# Altium schematic sheet BEEP.SchDoc
size A4
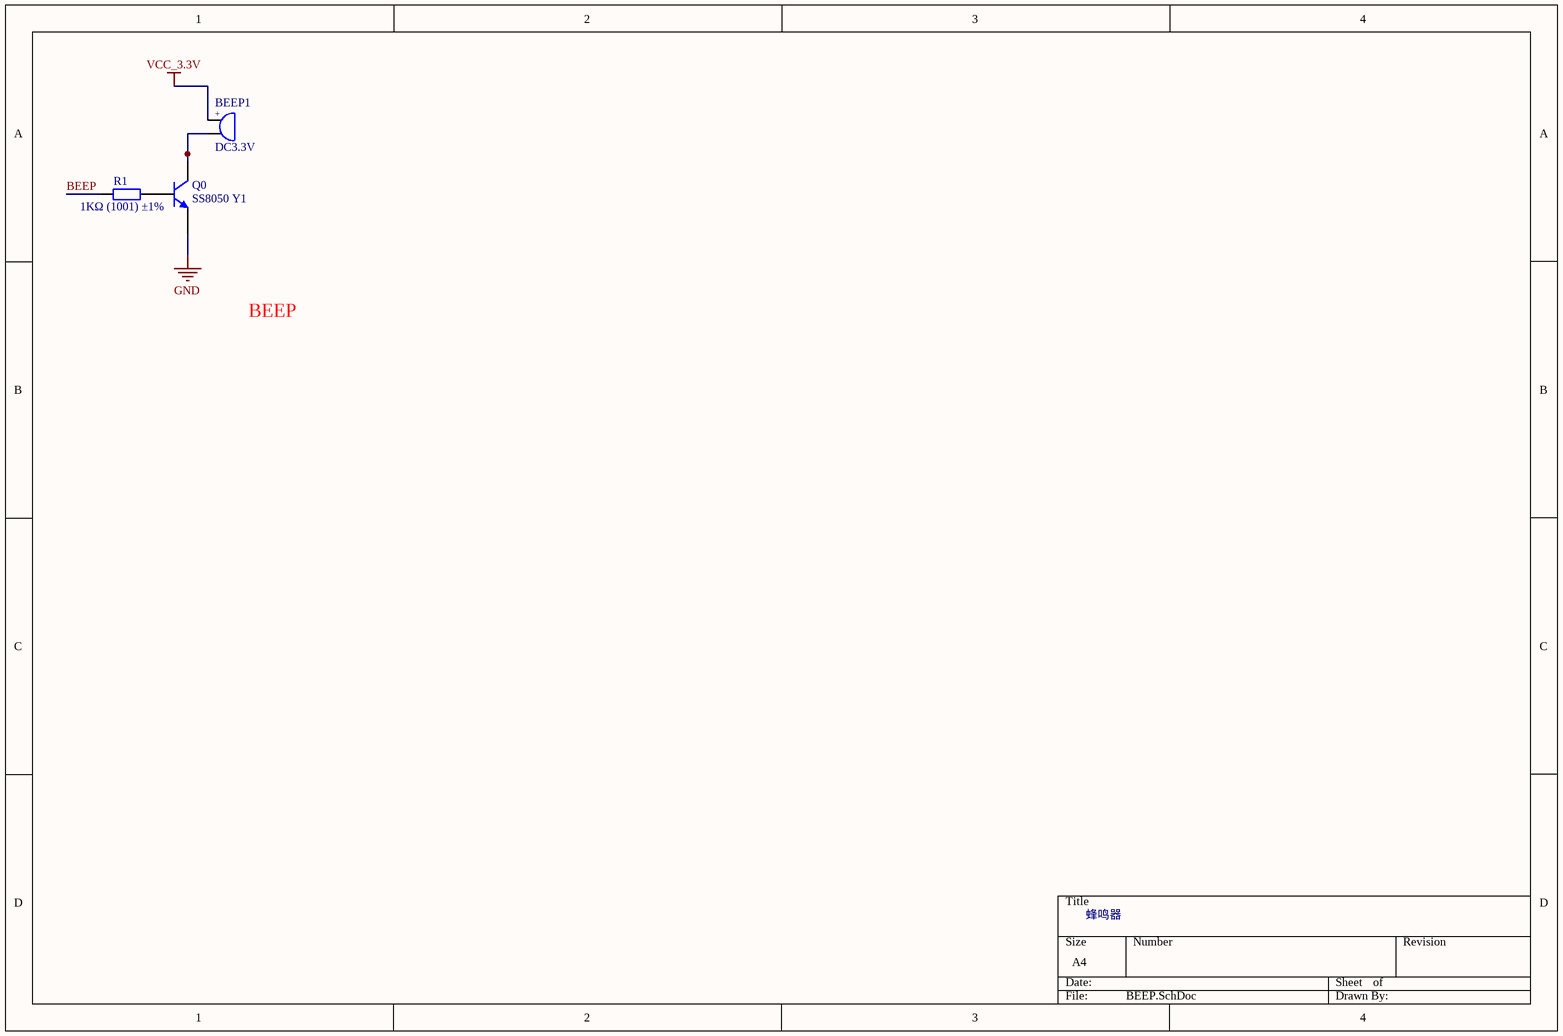
[diagram p0: BEEP.SchDoc]

## Parts
BEEP1  DC3.3V  [BUZZ_7.6]
Q0  SS8050 Y1  [SOT-23(SOT-23-3)]
R1  1KΩ (1001) ±1%  [RESC_0603_2]

## Nets
GND: Q0.2(E)
VCC_3.3V: BEEP1.1
BEEP: R1.1
NetBEEP1_2: BEEP1.2 Q0.3(C)

Not connected (* = marked no-connect by the designer): Q0 1(B); R1 2

## Notes on the sheet
- BEEP
- 蜂鸣器
- (in symbol BEEP) +

## Library data of the parts
BEEP1 = BEEP: 蜂鸣器
Q0 = SOT-23 SS8050 Y1: 三极管; ComponentLink1Description: 供应商链接; ComponentLink1URL: http://www.szlcsc.com/product/details_2507.html; Package: SOT-23; Supplier: LC; SuppliersPartNumber: C2150
R1 = 0603 1KΩ (1001) 1%: 贴片电阻; ComponentLink1Description: 供应商链接; ComponentLink1URL: http://www.szlcsc.com/product/details_21904.html; Package: 0603; Supplier: LC; SuppliersPartNumber: C21190